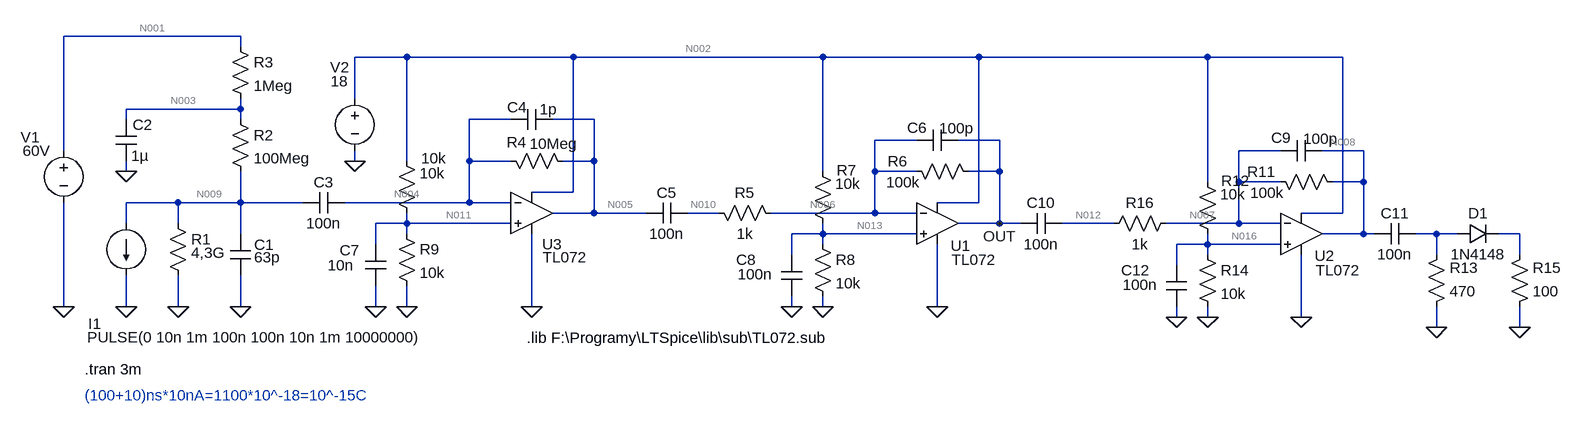
[diagram p0: schematic PIN gamma simulation.asc]
PIN gamma simulation.asc, the LTspice schematic file:
Version 4
SHEET 1 2708 1012
WIRE 256 -192 -16 -192
WIRE 256 -176 256 -192
WIRE 512 -160 432 -160
WIRE 768 -160 512 -160
WIRE 1152 -160 768 -160
WIRE 1392 -160 1152 -160
WIRE 1744 -160 1392 -160
WIRE 1952 -160 1744 -160
WIRE 432 -96 432 -160
WIRE 256 -80 256 -96
WIRE 256 -80 80 -80
WIRE 80 -64 80 -80
WIRE 256 -64 256 -80
WIRE 672 -64 608 -64
WIRE 800 -64 736 -64
WIRE 1296 -32 1232 -32
WIRE 1424 -32 1360 -32
WIRE -16 -16 -16 -192
WIRE 1856 -16 1792 -16
WIRE 1984 -16 1920 -16
WIRE 432 0 432 -16
WIRE 512 0 512 -160
WIRE 608 0 608 -64
WIRE 672 0 608 0
WIRE 800 0 800 -64
WIRE 800 0 752 0
WIRE 80 16 80 0
WIRE 1152 16 1152 -160
WIRE 1232 16 1232 -32
WIRE 1296 16 1232 16
WIRE 1424 16 1424 -32
WIRE 1424 16 1376 16
WIRE 1744 32 1744 -160
WIRE 1792 32 1792 -16
WIRE 1856 32 1792 32
WIRE 1984 32 1984 -16
WIRE 1984 32 1936 32
WIRE 768 48 768 -160
WIRE 768 48 704 48
WIRE 160 64 80 64
WIRE 256 64 256 16
WIRE 256 64 160 64
WIRE 352 64 256 64
WIRE 608 64 608 0
WIRE 608 64 416 64
WIRE 672 64 608 64
WIRE 1392 64 1392 -160
WIRE 1392 64 1328 64
WIRE 800 80 800 0
WIRE 800 80 736 80
WIRE 880 80 800 80
WIRE 992 80 944 80
WIRE 1232 80 1232 16
WIRE 1232 80 1072 80
WIRE 1296 80 1232 80
WIRE 1952 80 1952 -160
WIRE 1952 80 1888 80
WIRE 80 96 80 64
WIRE 160 96 160 64
WIRE 512 96 512 80
WIRE 512 96 464 96
WIRE 672 96 512 96
WIRE 1424 96 1424 16
WIRE 1424 96 1360 96
WIRE 1456 96 1424 96
WIRE 1600 96 1520 96
WIRE 1792 96 1792 32
WIRE 1792 96 1680 96
WIRE 1856 96 1792 96
WIRE 256 112 256 64
WIRE 512 112 512 96
WIRE 1152 112 1152 96
WIRE 1152 112 1104 112
WIRE 1296 112 1152 112
WIRE 1984 112 1984 32
WIRE 1984 112 1920 112
WIRE 2000 112 1984 112
WIRE 2096 112 2064 112
WIRE 2128 112 2096 112
WIRE 2224 112 2192 112
WIRE 464 128 464 96
WIRE 1152 128 1152 112
WIRE 1744 128 1744 112
WIRE 1744 128 1696 128
WIRE 1856 128 1744 128
WIRE 1104 144 1104 112
WIRE 1744 144 1744 128
WIRE 2096 144 2096 112
WIRE 2224 144 2224 112
WIRE 1696 160 1696 128
WIRE -16 224 -16 64
WIRE 80 224 80 176
WIRE 160 224 160 176
WIRE 256 224 256 176
WIRE 464 224 464 192
WIRE 512 224 512 192
WIRE 704 224 704 112
WIRE 1104 224 1104 208
WIRE 1152 224 1152 208
WIRE 1328 224 1328 128
WIRE 1696 240 1696 224
WIRE 1744 240 1744 224
WIRE 1888 240 1888 144
WIRE 2096 256 2096 224
WIRE 2224 256 2224 224
FLAG 80 224 0
FLAG 160 224 0
FLAG 256 224 0
FLAG 80 16 0
FLAG -16 224 0
FLAG 1152 224 0
FLAG 1328 224 0
FLAG 512 224 0
FLAG 704 224 0
FLAG 432 0 0
FLAG 464 224 0
FLAG 1104 224 0
FLAG 1888 240 0
FLAG 1744 240 0
FLAG 1696 240 0
FLAG 2096 256 0
FLAG 2224 256 0
FLAG 1424 96 OUT
SYMBOL res 144 80 R0
WINDOW 3 36 61 Left 2
SYMATTR Value 4,3G
SYMATTR InstName R1
SYMATTR SpiceLine tol=1 pwr=0.1
SYMBOL cap 240 112 R0
WINDOW 0 37 17 Left 2
WINDOW 3 37 36 Left 2
SYMATTR InstName C1
SYMATTR Value 63p
SYMBOL res 240 -80 R0
SYMATTR InstName R2
SYMATTR Value 100Meg
SYMBOL cap 64 -64 R0
WINDOW 0 26 8 Left 2
SYMATTR InstName C2
SYMATTR Value 1µ
SYMATTR SpiceLine V=63 Irms=0 Rser=0.305 Lser=7.48655p
SYMBOL res 240 -192 R0
SYMATTR InstName R3
SYMATTR Value 1Meg
SYMBOL voltage -16 -32 R0
WINDOW 123 0 0 Left 2
WINDOW 39 0 0 Left 2
WINDOW 0 -66 -5 Left 2
WINDOW 3 -63 16 Left 2
SYMATTR InstName V1
SYMATTR Value 60V
SYMBOL cap 352 48 M90
WINDOW 0 0 32 VBottom 2
WINDOW 3 32 32 VTop 2
SYMATTR InstName C3
SYMATTR Value 100n
SYMBOL Opamps\\opamp2 704 16 R0
WINDOW 0 16 112 Left 2
WINDOW 3 17 132 Left 2
SYMATTR InstName U3
SYMATTR Value TL072
SYMBOL cap 672 -80 M90
WINDOW 0 13 10 VBottom 2
WINDOW 3 -15 58 VTop 2
SYMATTR InstName C4
SYMATTR Value 1p
SYMBOL res 768 16 M270
WINDOW 0 29 87 VTop 2
WINDOW 3 58 30 VBottom 2
SYMATTR InstName R4
SYMATTR Value 10Meg
SYMBOL res 1088 96 M270
WINDOW 0 32 56 VTop 2
WINDOW 3 0 56 VBottom 2
SYMATTR InstName R5
SYMATTR Value 1k
SYMBOL Opamps\\opamp2 1328 32 R0
WINDOW 0 21 98 Left 2
WINDOW 3 22 120 Left 2
SYMATTR InstName U1
SYMATTR Value TL072
SYMBOL res 1392 32 M270
WINDOW 0 16 125 VTop 2
WINDOW 3 15 116 VBottom 2
SYMATTR InstName R6
SYMATTR Value 100k
SYMBOL cap 1296 -48 M90
WINDOW 0 12 1 VBottom 2
WINDOW 3 -18 62 VTop 2
SYMATTR InstName C6
SYMATTR Value 100p
SYMBOL res 1136 0 R0
WINDOW 0 37 14 Left 2
WINDOW 3 35 35 Left 2
SYMATTR InstName R7
SYMATTR Value 10k
SYMBOL res 1136 112 R0
SYMATTR InstName R8
SYMATTR Value 10k
SYMBOL res 496 96 R0
SYMATTR InstName R9
SYMATTR Value 10k
SYMBOL res 496 -16 R0
WINDOW 0 38 12 Left 2
WINDOW 3 36 35 Left 2
SYMATTR InstName 10k
SYMATTR Value 10k
SYMBOL voltage 432 -112 R0
WINDOW 0 -38 -32 Left 2
WINDOW 3 -37 -11 Left 2
WINDOW 123 0 0 Left 2
WINDOW 39 0 0 Left 2
SYMATTR InstName V2
SYMATTR Value 18
SYMBOL current 80 96 R0
WINDOW 123 0 0 Left 2
WINDOW 39 24 28 Left 2
WINDOW 0 -58 154 Left 2
WINDOW 3 -60 175 Left 2
SYMATTR InstName I1
SYMATTR Value PULSE(0 10n 1m 100n 100n 10n 1m 10000000)
SYMBOL cap 944 96 M270
WINDOW 0 32 32 VTop 2
WINDOW 3 0 32 VBottom 2
SYMATTR InstName C5
SYMATTR Value 100n
SYMBOL cap 448 128 R0
WINDOW 0 -39 9 Left 2
WINDOW 3 -58 32 Left 2
SYMATTR InstName C7
SYMATTR Value 10n
SYMATTR SpiceLine V=63 Irms=0 Rser=0.305 Lser=7.48655p
SYMBOL cap 1088 144 R0
WINDOW 0 -69 8 Left 2
WINDOW 3 -67 30 Left 2
SYMATTR InstName C8
SYMATTR Value 100n
SYMATTR SpiceLine V=63 Irms=0 Rser=0.305 Lser=7.48655p
SYMBOL Opamps\\opamp2 1888 48 R0
WINDOW 0 21 98 Left 2
WINDOW 3 22 120 Left 2
SYMATTR InstName U2
SYMATTR Value TL072
SYMBOL res 1952 48 M270
WINDOW 0 16 125 VTop 2
WINDOW 3 15 116 VBottom 2
SYMATTR InstName R11
SYMATTR Value 100k
SYMBOL cap 1856 -32 M90
WINDOW 0 12 1 VBottom 2
WINDOW 3 -18 62 VTop 2
SYMATTR InstName C9
SYMATTR Value 100p
SYMBOL cap 1520 112 M270
WINDOW 0 32 32 VTop 2
WINDOW 3 0 32 VBottom 2
SYMATTR InstName C10
SYMATTR Value 100n
SYMBOL res 2080 240 M180
WINDOW 0 36 76 Left 2
WINDOW 3 36 40 Left 2
SYMATTR InstName R13
SYMATTR Value 470
SYMBOL cap 2064 128 M270
WINDOW 0 32 32 VTop 2
WINDOW 3 0 32 VBottom 2
SYMATTR InstName C11
SYMATTR Value 100n
SYMBOL res 1728 16 R0
WINDOW 0 37 14 Left 2
WINDOW 3 35 35 Left 2
SYMATTR InstName R12
SYMATTR Value 10k
SYMBOL res 1728 128 R0
SYMATTR InstName R14
SYMATTR Value 10k
SYMBOL cap 1680 160 R0
WINDOW 0 -69 8 Left 2
WINDOW 3 -67 30 Left 2
SYMATTR InstName C12
SYMATTR Value 100n
SYMATTR SpiceLine V=63 Irms=0 Rser=0.305 Lser=7.48655p
SYMBOL diode 2128 128 R270
WINDOW 0 32 32 VTop 2
WINDOW 3 0 32 VBottom 2
SYMATTR InstName D1
SYMATTR Value 1N4148
SYMBOL res 2208 240 M180
WINDOW 0 36 76 Left 2
WINDOW 3 36 40 Left 2
SYMATTR InstName R15
SYMATTR Value 100
SYMBOL res 1696 80 R90
WINDOW 0 0 56 VBottom 2
WINDOW 3 32 56 VTop 2
SYMATTR InstName R16
SYMATTR Value 1k
TEXT 696 272 Left 2 !.lib F:\\Programy\\LTSpice\\lib\\sub\\TL072.sub
TEXT 16 320 Left 2 !.tran 3m
TEXT 16 360 Left 2 ;(100+10)ns*10nA=1100*10^-18=10^-15C

The netlist it stands for:
* PIN gamma simulation.asc
R1 N009 0 4,3G tol=1 pwr=0.1
C1 N009 0 63p
R2 N003 N009 100Meg
C2 N003 0 1µ V=63 Irms=0 Rser=0.305 Lser=7.48655p
R3 N001 N003 1Meg
V1 N001 0 60V
C3 N009 N004 100n
XU3 N011 N004 N002 0 N005 TL072  ; pins In+ In- V+ V- OUT
C4 N004 N005 1p
R4 N005 N004 10Meg
R5 N006 N010 1k
XU1 N013 N006 N002 0 OUT TL072  ; pins In+ In- V+ V- OUT
R6 OUT N006 100k
C6 N006 OUT 100p
R7 N002 N013 10k
R8 N013 0 10k
R9 N011 0 10k
R§10k N002 N011 10k
V2 N002 0 18
I1 N009 0 PULSE(0 10n 1m 100n 100n 10n 1m 10000000)
C5 N010 N005 100n
C7 N011 0 10n V=63 Irms=0 Rser=0.305 Lser=7.48655p
C8 N013 0 100n V=63 Irms=0 Rser=0.305 Lser=7.48655p
XU2 N016 N007 N002 0 N008 TL072  ; pins In+ In- V+ V- OUT
R11 N008 N007 100k
C9 N007 N008 100p
C10 N012 OUT 100n
R13 0 N014 470
C11 N014 N008 100n
R12 N002 N016 10k
R14 N016 0 10k
C12 N016 0 100n V=63 Irms=0 Rser=0.305 Lser=7.48655p
D1 N014 N015 1N4148
R15 0 N015 100
R16 N007 N012 1k
.model D D
.lib standard.dio
.lib F:\Programy\LTSpice\lib\sub\TL072.sub
.tran 3m
* (100+10)ns*10nA=1100*10^-18=10^-15C
.backanno
.end

* Results of the author's LTspice run, read from the files saved beside the schematic
* Operating Point, zero values left out:
*   V(n009) = 58.05 V
*   V(n003) = 59.98 V
*   V(n001) = 60 V
*   V(n004) = 9 V
*   V(n005) = 9 V
*   V(n002) = 18 V
*   V(n011) = 9 V
*   V(n006) = 9 V
*   V(n010) = 9 V
*   V(out) = 9 V
*   V(n013) = 9 V
*   V(n008) = 9 V
*   V(n007) = 9 V
*   V(n016) = 9 V
*   V(n012) = 9 V
*   I(R14) = 900 µA
*   I(R12) = 900 µA
*   I(R11) = 39.05 pA
*   I(10k) = 900 µA
*   I(R9) = 900 µA
*   I(R8) = 900 µA
*   I(R7) = 900 µA
*   I(R6) = 39.05 pA
*   I(R4) = 39.05 pA
*   I(R3) = 19.35 nA
*   I(R2) = 19.35 nA
*   I(R1) = 19.35 nA
*   I(V2) = -28.48 mA
*   I(V1) = -19.35 nA
*   Ix(u3:1) = 39.05 pA
*   Ix(u3:2) = 39.05 pA
*   Ix(u3:3) = 8.594 mA
*   Ix(u3:4) = -8.595 mA
*   Ix(u3:5) = -39.05 pA
*   Ix(u1:1) = 39.05 pA
*   Ix(u1:2) = 39.05 pA
*   Ix(u1:3) = 8.594 mA
*   Ix(u1:4) = -8.595 mA
*   Ix(u1:5) = -39.05 pA
*   Ix(u2:1) = 39.05 pA
*   Ix(u2:2) = 39.05 pA
*   Ix(u2:3) = 8.594 mA
*   Ix(u2:4) = -8.595 mA
*   Ix(u2:5) = -39.05 pA